# Altium project Underwater_ROV_AuxBoard.PrjPcb
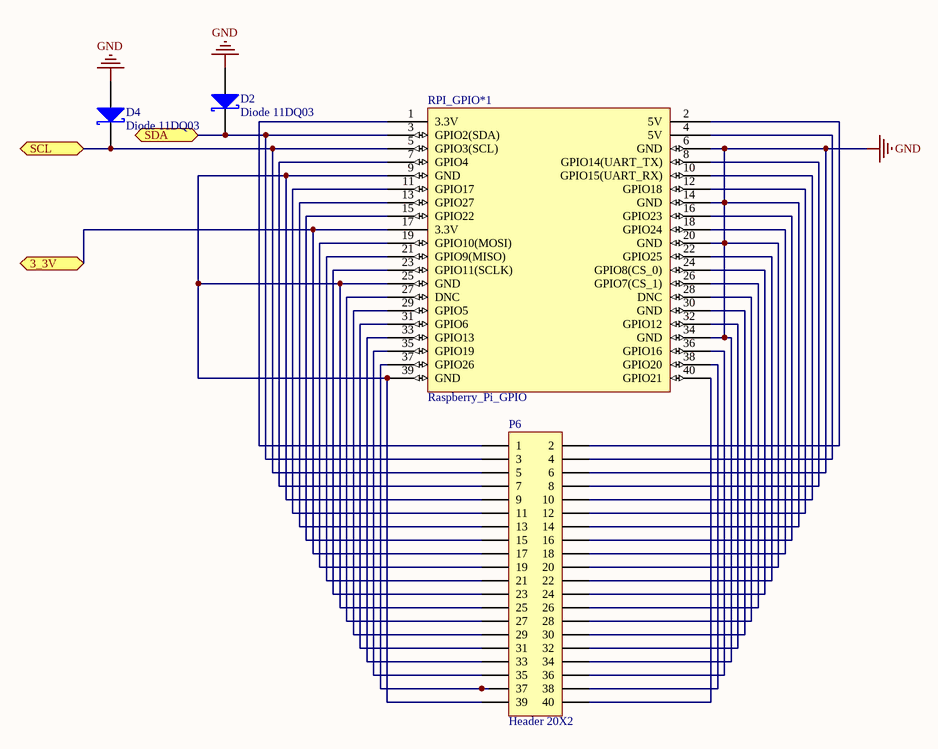
[diagram p0: Underwater_ROV_RPI.SchDoc]
4 sheets, 57 parts. Net scope: global (net labels, ports and power ports of the same name join across sheets).
Board file: Underwater_ROV_Aux.PcbDoc
Sheets:
  Underwater_ROV_RPI.SchDoc
  Underwater_ROV_Servos.SchDoc
  Underwater_ROV_Sensors.SchDoc
  Underwater_ROV_ESCS.SchDoc

## Sheet Underwater_ROV_RPI.SchDoc
size A

### Parts
D2  Diode 11DQ03  [DO-204AL]
D4  Diode 11DQ03  [DO-204AL]
P6  Header 20X2  [HDR2X20]
RPI_GPIO*1  Raspberry_Pi_GPIO  [HDR2X20]

### Ports
3_3V (bidir), SCL (bidir), SDA (bidir)

### Nets
GND: D2.1(A) D4.1(A) P6.6 P6.14 P6.20 P6.34 RPI_GPIO*1.6(GND) RPI_GPIO*1.14(GND) RPI_GPIO*1.20(GND) RPI_GPIO*1.34(GND)
3_3V: P6.17 RPI_GPIO*1.17(3.3V) ; port 3_3V
SCL: D4.2(K) P6.5 RPI_GPIO*1.5(GPIO3(SCL)) ; port SCL
SDA: D2.2(K) P6.3 RPI_GPIO*1.3(GPIO2(SDA)) ; port SDA
NetP6_1: P6.1 RPI_GPIO*1.1(3.3V)
NetP6_2: P6.2 RPI_GPIO*1.2(5V)
NetP6_4: P6.4 RPI_GPIO*1.4(5V)
NetP6_7: P6.7 RPI_GPIO*1.7(GPIO4)
NetP6_8: P6.8 RPI_GPIO*1.8(GPIO14(UART_TX))
NetP6_9: P6.9 P6.25 P6.39 RPI_GPIO*1.9(GND) RPI_GPIO*1.25(GND) RPI_GPIO*1.39(GND)
NetP6_10: P6.10 RPI_GPIO*1.10(GPIO15(UART_RX))
NetP6_11: P6.11 RPI_GPIO*1.11(GPIO17)
NetP6_12: P6.12 RPI_GPIO*1.12(GPIO18)
NetP6_13: P6.13 RPI_GPIO*1.13(GPIO27)
NetP6_15: P6.15 RPI_GPIO*1.15(GPIO22)
NetP6_16: P6.16 RPI_GPIO*1.16(GPIO23)
NetP6_18: P6.18 RPI_GPIO*1.18(GPIO24)
NetP6_19: P6.19 RPI_GPIO*1.19(GPIO10(MOSI))
NetP6_21: P6.21 RPI_GPIO*1.21(GPIO9(MISO))
NetP6_22: P6.22 RPI_GPIO*1.22(GPIO25)
NetP6_23: P6.23 RPI_GPIO*1.23(GPIO11(SCLK))
NetP6_24: P6.24 RPI_GPIO*1.24(GPIO8(CS_0))
NetP6_26: P6.26 RPI_GPIO*1.26(GPIO7(CS_1))
NetP6_27: P6.27 RPI_GPIO*1.27(DNC)
NetP6_28: P6.28 RPI_GPIO*1.28(DNC)
NetP6_29: P6.29 RPI_GPIO*1.29(GPIO5)
NetP6_30: P6.30 RPI_GPIO*1.30(GND)
NetP6_31: P6.31 RPI_GPIO*1.31(GPIO6)
NetP6_32: P6.32 RPI_GPIO*1.32(GPIO12)
NetP6_33: P6.33 RPI_GPIO*1.33(GPIO13)
NetP6_35: P6.35 RPI_GPIO*1.35(GPIO19)
NetP6_36: P6.36 RPI_GPIO*1.36(GPIO16)
NetP6_37: P6.37 RPI_GPIO*1.37(GPIO26)
NetP6_38: P6.38 RPI_GPIO*1.38(GPIO20)
NetP6_40: P6.40 RPI_GPIO*1.40(GPIO21)

### Library data of the parts
D2 D4 = Diode 11DQ03: Schottky Rectifier; Published: 8-Jun-2000; LatestRevisionDate: 17-Jul-2002; LatestRevisionNote: Re-released for DXP Platform.; DatasheetVersion: Dec-1997; PackageReference: DO-204AL; Publisher: Altium Limited; PackageDescription: Diode, Axial; Body 5.2 x 2.7 mm (LxDia. max), Lead Dia. 0.86 mm (max); Code_JEDEC: DO-204-AL; ComponentLink1Description: Manufacturer Link; ComponentLink1URL: http://www.irf.com/; ComponentLink2Description: Datasheet; ComponentLink2URL: http://www.irf.com/product-info/datasheets/data/11dq03.pdf
P6 = Header 20X2: Header, 20-Pin, Dual row; LatestRevisionDate: 17-Jul-2002; LatestRevisionNote: Re-released for DXP Platform.; Publisher: Altium Limited

## Sheet Underwater_ROV_Servos.SchDoc
size A
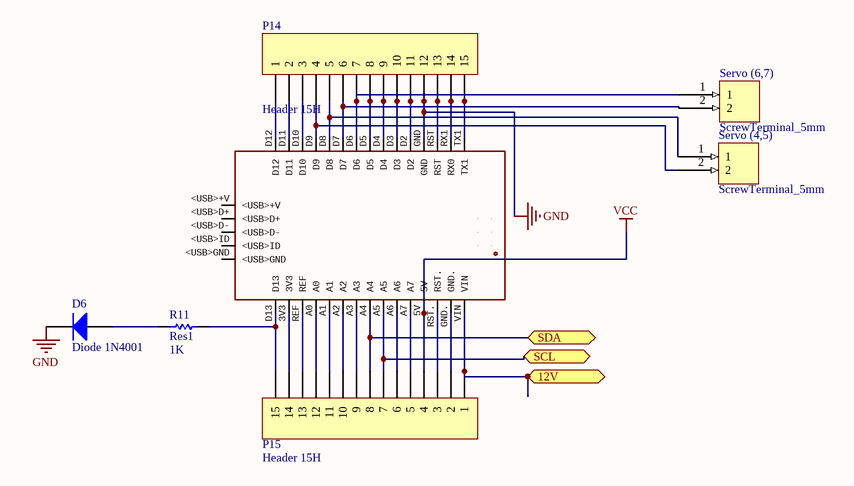
[diagram p1: Underwater_ROV_Servos.SchDoc]

### Parts
D6  Diode 1N4001  [DO-41]
Nano_servos  Device for representing an Arduino Nano board with a footprint in an EAGLE design. Created by Dave Young for Element14. More EAGLE documentation at: http://www.element14.com/community/community/knode/cadsoft_eagle  [ARDUINO_NANO]  (value not drawn)
P14  Header 15H  [HDR1X15H]
P15  Header 15H  [HDR1X15H]
R11  Res1  value 1K  [AXIAL-0.3]
Servo_(4,5)  ScrewTerminal_5mm  [Screw_Terminal_5mm]
Servo_(6,7)  ScrewTerminal_5mm  [Screw_Terminal_5mm]

### Ports
12V (bidir), SCL (bidir), SDA (bidir)

### Nets
GND: D6.2(K) Nano_servos.GND P14.12
VCC: Nano_servos.5V P15.4
12V: Nano_servos.VIN P15.1 ; port 12V
SCL: Nano_servos.A5 P15.7 ; port SCL
SDA: Nano_servos.A4 P15.8 ; port SDA
NetD6_1: D6.1(A) R11.1
NetNano_servos_3V3: Nano_servos.3V3 P15.14
NetNano_servos_A0: Nano_servos.A0 P15.12
NetNano_servos_A1: Nano_servos.A1 P15.11
NetNano_servos_A2: Nano_servos.A2 P15.10
NetNano_servos_A3: Nano_servos.A3 P15.9
NetNano_servos_A6: Nano_servos.A6 P15.6
NetNano_servos_A7: Nano_servos.A7 P15.5
NetNano_servos_D2: Nano_servos.D2 P14.11
NetNano_servos_D3: Nano_servos.D3 P14.10
NetNano_servos_D4: Nano_servos.D4 P14.9
NetNano_servos_D5: Nano_servos.D5 P14.8
NetNano_servos_D6: Nano_servos.D6 P14.7 Servo_(6,7).1
NetNano_servos_D7: Nano_servos.D7 P14.6 Servo_(6,7).2
NetNano_servos_D8: Nano_servos.D8 P14.5 Servo_(4,5).1
NetNano_servos_D9: Nano_servos.D9 P14.4 Servo_(4,5).2
NetNano_servos_D10: Nano_servos.D10 P14.3
NetNano_servos_D11: Nano_servos.D11 P14.2
NetNano_servos_D12: Nano_servos.D12 P14.1
NetNano_servos_D13: Nano_servos.D13 P15.15 R11.2
NetNano_servos_GND.: Nano_servos.GND. P15.2
NetNano_servos_REF: Nano_servos.REF P15.13
NetNano_servos_RST: Nano_servos.RST P14.13
NetNano_servos_RST.: Nano_servos.RST. P15.3
NetNano_servos_RX1: Nano_servos.RX1(RX0) P14.14
NetNano_servos_TX1: Nano_servos.TX1 P14.15

Not connected (* = marked no-connect by the designer): Nano_servos 5V. <USB>+V <USB>D+ <USB>D- <USB>GND <USB>ID GND_ MISO MOSI RESET.. SCK

### Library data of the parts
D6 = Diode 1N4001: 1 Amp General Purpose Rectifier; Published: 8-Jun-2000; LatestRevisionDate: 17-Jul-2002; LatestRevisionNote: Re-released for DXP Platform.; DatasheetVersion: 1998; PackageVersion: Aug-1999; PackageReference: DO-41; Publisher: Altium Limited; PackageDescription: Diode, Axial; Body 5.2 x 2.7 mm (LxDia. max), Lead Dia. 0.86 mm (max); Code_JEDEC: DO-204-AL; ComponentLink1Description: Manufacturer Link; ComponentLink1URL: http://www.fairchildsemi.com/; ComponentLink2Description: Datasheet; ComponentLink2URL: http://www.fairchildsemi.com/ds/1N%2F1N4001.pdf
Nano_servos = ARDUINO_NANO
P14 P15 = Header 15H: Header, 15-Pin, Right Angle; LatestRevisionDate: 17-Jul-2002; LatestRevisionNote: Re-released for DXP Platform.; Publisher: Altium Limited
R11 = Res1: Resistor; Published: 8-Jun-2000; LatestRevisionDate: 17-Jul-2002; LatestRevisionNote: Re-released for DXP Platform.; PackageReference: AXIAL-0.3; Publisher: Altium Limited; PackageDescription: Axial Device, Thru-Hole; 2 Leads; 0.3 in Pin Spacing

## Sheet Underwater_ROV_Sensors.SchDoc
size A
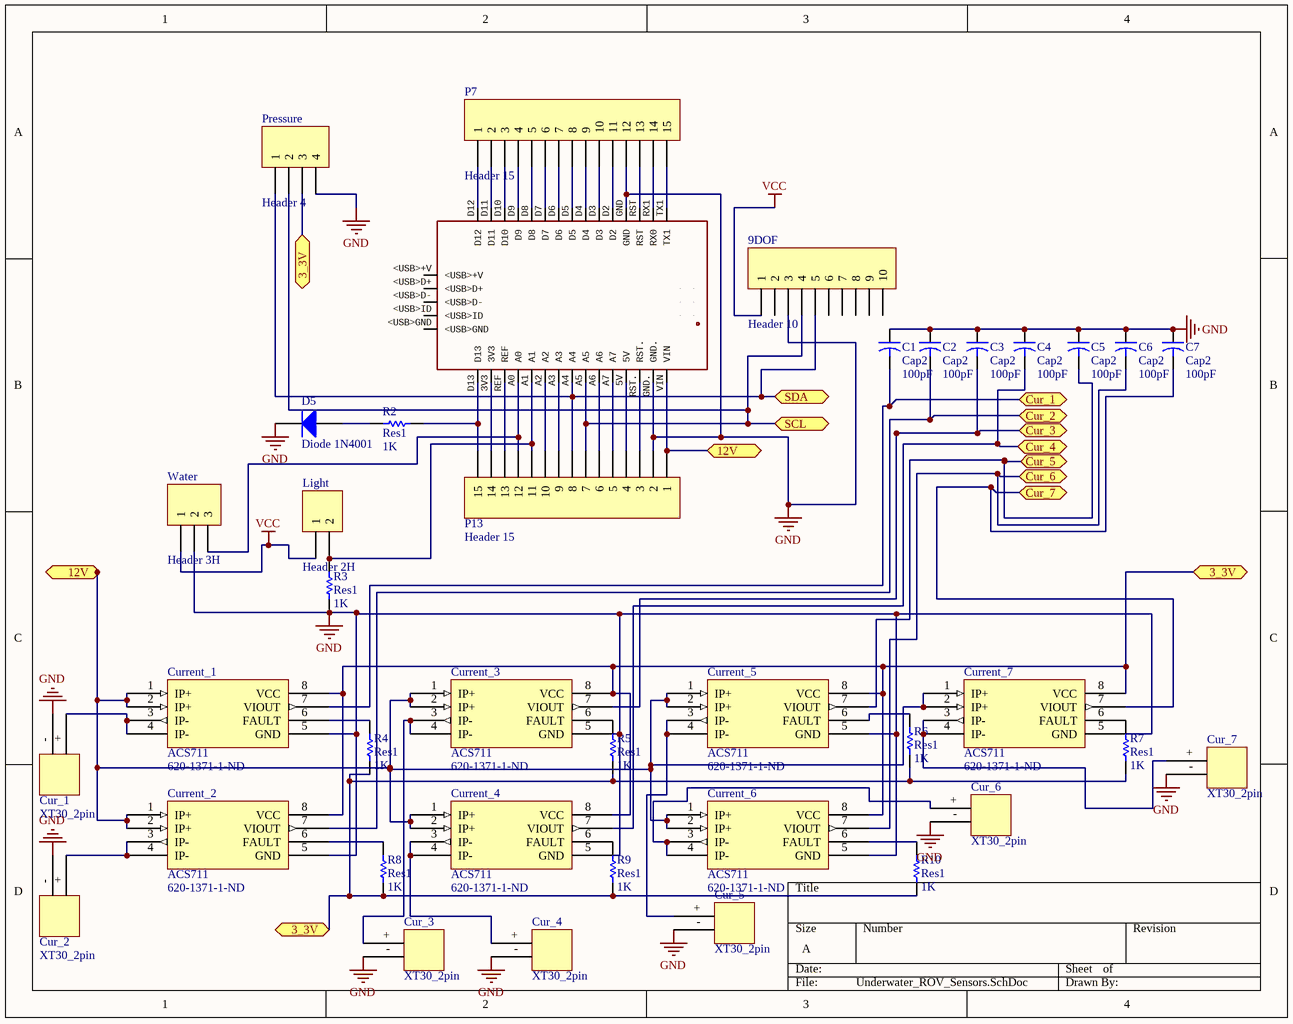
[diagram p2: Underwater_ROV_Sensors.SchDoc]

### Parts
9DOF  Header 10  [HDR1X10]
C1  Cap2  value 100pF  [CAPR5-4X5]
C2  Cap2  value 100pF  [CAPR5-4X5]
C3  Cap2  value 100pF  [CAPR5-4X5]
C4  Cap2  value 100pF  [CAPR5-4X5]
C5  Cap2  value 100pF  [CAPR5-4X5]
C6  Cap2  value 100pF  [CAPR5-4X5]
C7  Cap2  value 100pF  [CAPR5-4X5]
Cur_1  XT30_2pin  [XT30_2pin]
Cur_2  XT30_2pin  [XT30_2pin]
Cur_3  XT30_2pin  [XT30_2pin]
Cur_4  XT30_2pin  [XT30_2pin]
Cur_5  XT30_2pin  [XT30_2pin]
Cur_6  XT30_2pin  [XT30_2pin]
Cur_7  XT30_2pin  [XT30_2pin]
Current_1  ACS711  Supplier Part Number 1: 620-1371-1-ND  [SOIC127P600X175-8N]
Current_2  ACS711  Supplier Part Number 1: 620-1371-1-ND  [SOIC127P600X175-8N]
Current_3  ACS711  Supplier Part Number 1: 620-1371-1-ND  [SOIC127P600X175-8N]
Current_4  ACS711  Supplier Part Number 1: 620-1371-1-ND  [SOIC127P600X175-8N]
Current_5  ACS711  Supplier Part Number 1: 620-1371-1-ND  [SOIC127P600X175-8N]
Current_6  ACS711  Supplier Part Number 1: 620-1371-1-ND  [SOIC127P600X175-8N]
Current_7  ACS711  Supplier Part Number 1: 620-1371-1-ND  [SOIC127P600X175-8N]
D5  Diode 1N4001  [DO-41]
Light  Header 2H  [HDR1X2H]
Nano_sens  Device for representing an Arduino Nano board with a footprint in an EAGLE design. Created by Dave Young for Element14. More EAGLE documentation at: http://www.element14.com/community/community/knode/cadsoft_eagle  [ARDUINO_NANO]  (value not drawn)
P7  Header 15  [HDR1X15]
P13  Header 15  [HDR1X15]
Pressure  Header 4  [HDR1X4]
R2  Res1  value 1K  [AXIAL-0.3]
R3  Res1  value 1K  [AXIAL-0.3]
R4  Res1  value 1K  [AXIAL-0.3]
R5  Res1  value 1K  [AXIAL-0.3]
R6  Res1  value 1K  [AXIAL-0.3]
R7  Res1  value 1K  [AXIAL-0.3]
R8  Res1  value 1K  [AXIAL-0.3]
R9  Res1  value 1K  [AXIAL-0.3]
R10  Res1  value 1K  [AXIAL-0.3]
Water  Header 3H  [HDR1X3H]

### Ports
3_3V (bidir), 12V (bidir), Cur_1 (bidir), Cur_2, Cur_3, Cur_4 (bidir), Cur_5, Cur_6, Cur_7, SCL (bidir), SDA (bidir)

### Nets
GND: 9DOF.3 C1.1 C2.1 C3.1 C4.1 C5.1 C6.1 C7.1 Cur_1.- Cur_2.- Cur_3.- Cur_4.- Cur_5.- Cur_6.- Cur_7.- Current_1.5(GND) Current_2.5(GND) Current_3.5(GND) Current_4.5(GND) Current_5.5(GND) Current_6.5(GND) Current_7.5(GND) D5.2(K) Nano_sens.GND Nano_sens.GND. P7.12 P13.2 Pressure.4 R3.1 Water.2
VCC: 9DOF.1 Light.1 Water.1
3_3V: Current_1.8(VCC) Current_2.8(VCC) Current_3.8(VCC) Current_4.8(VCC) Current_5.8(VCC) Current_6.8(VCC) Current_7.8(VCC) Pressure.3 R4.1 R5.1 R6.1 R7.1 R8.1 R9.1 R10.1 ; port 3_3V
12V: Current_1.1(IP+) Current_1.2(IP+) Current_2.1(IP+) Current_2.2(IP+) Current_3.1(IP+) Current_3.2(IP+) Current_4.1(IP+) Current_4.2(IP+) Current_5.1(IP+) Current_5.2(IP+) Current_6.1(IP+) Current_6.2(IP+) Current_7.1(IP+) Current_7.2(IP+) Nano_sens.VIN P13.1 ; port 12V
Cur_1: C1.2 Current_1.7(VIOUT) ; port Cur_1
Cur_2: C2.2 Current_2.7(VIOUT) ; port Cur_2
Cur_3: C3.2 Current_3.7(VIOUT) ; port Cur_3
Cur_4: C4.2 Current_4.7(VIOUT) ; port Cur_4
Cur_5: C5.2 Current_5.7(VIOUT) ; port Cur_5
Cur_6: C6.2 Current_6.7(VIOUT) ; port Cur_6
Cur_7: C7.2 Current_7.7(VIOUT) ; port Cur_7
SCL: 9DOF.4 Nano_sens.A5 P13.7 Pressure.2 ; port SCL
SDA: 9DOF.5 Nano_sens.A4 P13.8 Pressure.1 ; port SDA
NetCur_1_+: Cur_1.+ Current_1.3(IP-) Current_1.4(IP-)
NetCur_2_+: Cur_2.+ Current_2.3(IP-) Current_2.4(IP-)
NetCur_3_+: Cur_3.+ Current_3.3(IP-) Current_3.4(IP-)
NetCur_4_+: Cur_4.+ Current_4.3(IP-) Current_4.4(IP-)
NetCur_5_+: Cur_5.+ Current_5.3(IP-) Current_5.4(IP-)
NetCur_6_+: Cur_6.+ Current_6.3(IP-) Current_6.4(IP-)
NetCur_7_+: Cur_7.+ Current_7.3(IP-) Current_7.4(IP-)
NetCurrent_1_6: Current_1.6(FAULT) R4.2
NetCurrent_2_6: Current_2.6(FAULT) R8.2
NetCurrent_3_6: Current_3.6(FAULT) R5.2
NetCurrent_4_6: Current_4.6(FAULT) R9.2
NetCurrent_5_6: Current_5.6(FAULT) R6.2
NetCurrent_6_6: Current_6.6(FAULT) R10.2
NetCurrent_7_6: Current_7.6(FAULT) R7.2
NetD5_1: D5.1(A) R2.1
NetLight_2: Light.2 Nano_sens.A1 P13.11 R3.2
NetNano_sens_3V3: Nano_sens.3V3 P13.14
NetNano_sens_5V: Nano_sens.5V P13.4
NetNano_sens_A0: Nano_sens.A0 P13.12 Water.3
NetNano_sens_A2: Nano_sens.A2 P13.10
NetNano_sens_A3: Nano_sens.A3 P13.9
NetNano_sens_A6: Nano_sens.A6 P13.6
NetNano_sens_A7: Nano_sens.A7 P13.5
NetNano_sens_D2: Nano_sens.D2 P7.11
NetNano_sens_D3: Nano_sens.D3 P7.10
NetNano_sens_D4: Nano_sens.D4 P7.9
NetNano_sens_D5: Nano_sens.D5 P7.8
NetNano_sens_D6: Nano_sens.D6 P7.7
NetNano_sens_D7: Nano_sens.D7 P7.6
NetNano_sens_D8: Nano_sens.D8 P7.5
NetNano_sens_D9: Nano_sens.D9 P7.4
NetNano_sens_D10: Nano_sens.D10 P7.3
NetNano_sens_D11: Nano_sens.D11 P7.2
NetNano_sens_D12: Nano_sens.D12 P7.1
NetNano_sens_D13: Nano_sens.D13 P13.15 R2.2
NetNano_sens_REF: Nano_sens.REF P13.13
NetNano_sens_RST: Nano_sens.RST P7.13
NetNano_sens_RST.: Nano_sens.RST. P13.3
NetNano_sens_RX1: Nano_sens.RX1(RX0) P7.14
NetNano_sens_TX1: Nano_sens.TX1 P7.15

Not connected (* = marked no-connect by the designer): 9DOF 2 6 7 8 9 10; Nano_sens 5V. <USB>+V <USB>D+ <USB>D- <USB>GND <USB>ID GND_ MISO MOSI RESET.. SCK

### Library data of the parts
9DOF = Header 10: Header, 10-Pin; LatestRevisionDate: 17-Jul-2002; LatestRevisionNote: Re-released for DXP Platform.; Publisher: Altium Limited
C1-C7 = Cap2: Capacitor; Published: 23-Sep-2002; PackageReference: CAPR5-4X5; Publisher: Altium Limited; PackageDescription: Capacitor; 2 Leads
Current_1-Current_7 = ACS711: Manufacturer: Allegro MicroSystems, LLC; Manufacturer Part Number: ACS711ELCTR-25AB-T; For Measuring: AC/DC; Sensor Type: Hall Effect, Open Loop; Current - Sensing: 25A; Output: Ratiometric, Voltage; Sensitivity: 55mV/A; Frequency: DC ~ 100kHz; Linearity: ±1%; Accuracy: ±4%; Voltage - Supply: 3 V ~ 5.5 V; Response Time: 4.6µs; Current - Supply (Max): 5.5mA; Polarization: Bidirectional; Supplier 1: Digi-Key; RoHS: RoHS Compliant; Category: Sensors, Transducers; Stock 1: 19632; Pricing 1: 1=3.36, 5=3.116, 10=2.588, 25=2.1568, 50=1.9174, 100=1.8214, 500=1.53384, 1000=1.43798 (USD); Packaging: Cut Tape (CT); Part Status: Active; Operating Temperature: -40°C ~ 85°C; Mounting Type: Surface Mount; Package / Case: 8-SOIC (0.154", 3.90mm Width); ComponentLink1URL: http://www.allegromicro.com/~/media/Files/Datasheets/ACS711-Datasheet.ashx; ComponentLink1Description: http://www.allegromicro.com/~/media/Files/Datasheets/ACS711-Datasheet.ashx
D5 = Diode 1N4001: 1 Amp General Purpose Rectifier; Published: 8-Jun-2000; LatestRevisionDate: 17-Jul-2002; LatestRevisionNote: Re-released for DXP Platform.; DatasheetVersion: 1998; PackageVersion: Aug-1999; PackageReference: DO-41; Publisher: Altium Limited; PackageDescription: Diode, Axial; Body 5.2 x 2.7 mm (LxDia. max), Lead Dia. 0.86 mm (max); Code_JEDEC: DO-204-AL; ComponentLink1Description: Manufacturer Link; ComponentLink1URL: http://www.fairchildsemi.com/; ComponentLink2Description: Datasheet; ComponentLink2URL: http://www.fairchildsemi.com/ds/1N%2F1N4001.pdf
Light = Header 2H: Header, 2-Pin, Right Angle; LatestRevisionDate: 17-Jul-2002; LatestRevisionNote: Re-released for DXP Platform.; Publisher: Altium Limited
Nano_sens = ARDUINO_NANO
P7 P13 = Header 15: Header, 15-Pin; LatestRevisionDate: 17-Jul-2002; LatestRevisionNote: Re-released for DXP Platform.; Publisher: Altium Limited
Pressure = Header 4: Header, 4-Pin; LatestRevisionDate: 17-Jul-2002; LatestRevisionNote: Re-released for DXP Platform.; Publisher: Altium Limited
R2-R10 = Res1: Resistor; Published: 8-Jun-2000; LatestRevisionDate: 17-Jul-2002; LatestRevisionNote: Re-released for DXP Platform.; PackageReference: AXIAL-0.3; Publisher: Altium Limited; PackageDescription: Axial Device, Thru-Hole; 2 Leads; 0.3 in Pin Spacing
Water = Header 3H: Header, 3-Pin, Right Angle; LatestRevisionDate: 17-Jul-2002; LatestRevisionNote: Re-released for DXP Platform.; Publisher: Altium Limited

## Sheet Underwater_ROV_ESCS.SchDoc
size A
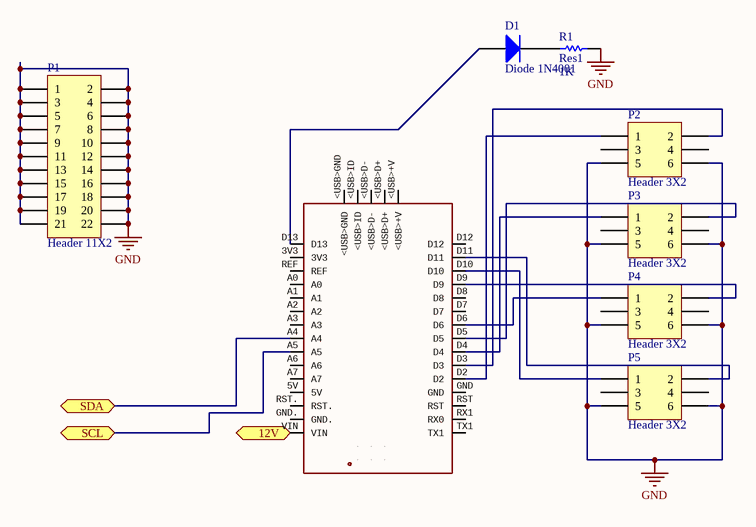
[diagram p3: Underwater_ROV_ESCS.SchDoc]

### Parts
D1  Diode 1N4001  [DO-41]
Nano_ESC  Device for representing an Arduino Nano board with a footprint in an EAGLE design. Created by Dave Young for Element14. More EAGLE documentation at: http://www.element14.com/community/community/knode/cadsoft_eagle  [ARDUINO_NANO]  (value not drawn)
P1  Header 11X2  [HDR2X11]
P2  Header 3X2  [HDR2X3]
P3  Header 3X2  [HDR2X3]
P4  Header 3X2  [HDR2X3]
P5  Header 3X2  [HDR2X3]
R1  Res1  value 1K  [AXIAL-0.3]

### Ports
12V (bidir), SCL (bidir), SDA (bidir)

### Nets
GND: P1.1 P1.2 P1.3 P1.4 P1.5 P1.6 P1.7 P1.8 P1.9 P1.10 P1.11 P1.12 P1.13 P1.14 P1.15 P1.16 P1.17 P1.18 P1.19 P1.20 P1.21 P1.22 P2.5 P2.6 P3.5 P3.6 P4.5 P4.6 P5.5 P5.6 R1.2
12V: Nano_ESC.VIN ; port 12V
SCL: Nano_ESC.A5 ; port SCL
SDA: Nano_ESC.A4 ; port SDA
NetD1_1: D1.1(A) Nano_ESC.D13
NetD1_2: D1.2(K) R1.1
NetNano_ESC_D2: Nano_ESC.D2 P2.1
NetNano_ESC_D3: Nano_ESC.D3 P2.2
NetNano_ESC_D4: Nano_ESC.D4 P3.1
NetNano_ESC_D5: Nano_ESC.D5 P3.2
NetNano_ESC_D6: Nano_ESC.D6 P4.1
NetNano_ESC_D9: Nano_ESC.D9 P4.2
NetNano_ESC_D10: Nano_ESC.D10 P5.1
NetNano_ESC_D11: Nano_ESC.D11 P5.2

Not connected (* = marked no-connect by the designer): Nano_ESC 3V3 5V 5V. <USB>+V <USB>D+ <USB>D- <USB>GND <USB>ID A0 A1 A2 A3 A6 A7 D7 D8 D12 GND GND. GND_ MISO MOSI REF RESET.. RST RST. RX1(RX0) SCK TX1; P2 3 4; P3 3 4; P4 3 4; P5 3 4

### Library data of the parts
D1 = Diode 1N4001: 1 Amp General Purpose Rectifier; Published: 8-Jun-2000; LatestRevisionDate: 17-Jul-2002; LatestRevisionNote: Re-released for DXP Platform.; DatasheetVersion: 1998; PackageVersion: Aug-1999; PackageReference: DO-41; Publisher: Altium Limited; PackageDescription: Diode, Axial; Body 5.2 x 2.7 mm (LxDia. max), Lead Dia. 0.86 mm (max); Code_JEDEC: DO-204-AL; ComponentLink1Description: Manufacturer Link; ComponentLink1URL: http://www.fairchildsemi.com/; ComponentLink2Description: Datasheet; ComponentLink2URL: http://www.fairchildsemi.com/ds/1N%2F1N4001.pdf
Nano_ESC = ARDUINO_NANO
P1 = Header 11X2: Header, 11-Pin, Dual row; LatestRevisionDate: 17-Jul-2002; LatestRevisionNote: Re-released for DXP Platform.; Publisher: Altium Limited
P2-P5 = Header 3X2: Header, 3-Pin, Dual row; LatestRevisionDate: 17-Jul-2002; LatestRevisionNote: Re-released for DXP Platform.; Publisher: Altium Limited
R1 = Res1: Resistor; Published: 8-Jun-2000; LatestRevisionDate: 17-Jul-2002; LatestRevisionNote: Re-released for DXP Platform.; PackageReference: AXIAL-0.3; Publisher: Altium Limited; PackageDescription: Axial Device, Thru-Hole; 2 Leads; 0.3 in Pin Spacing

## Nets that join several sheets
GND: Underwater_ROV_RPI (10 pins), Underwater_ROV_Servos (D6.2 Nano_servos.GND P14.12), Underwater_ROV_Sensors (30 pins), Underwater_ROV_ESCS (31 pins)
VCC: Underwater_ROV_Servos (Nano_servos.5V P15.4), Underwater_ROV_Sensors (9DOF.1 Light.1 Water.1)
3_3V: Underwater_ROV_RPI (P6.17 RPI_GPIO*1.17), Underwater_ROV_Sensors (15 pins)
12V: Underwater_ROV_Servos (Nano_servos.VIN P15.1), Underwater_ROV_Sensors (16 pins), Underwater_ROV_ESCS (Nano_ESC.VIN)
SCL: Underwater_ROV_RPI (D4.2 P6.5 RPI_GPIO*1.5), Underwater_ROV_Servos (Nano_servos.A5 P15.7), Underwater_ROV_Sensors (9DOF.4 Nano_sens.A5 P13.7 Pressure.2), Underwater_ROV_ESCS (Nano_ESC.A5)
SDA: Underwater_ROV_RPI (D2.2 P6.3 RPI_GPIO*1.3), Underwater_ROV_Servos (Nano_servos.A4 P15.8), Underwater_ROV_Sensors (9DOF.5 Nano_sens.A4 P13.8 Pressure.1), Underwater_ROV_ESCS (Nano_ESC.A4)